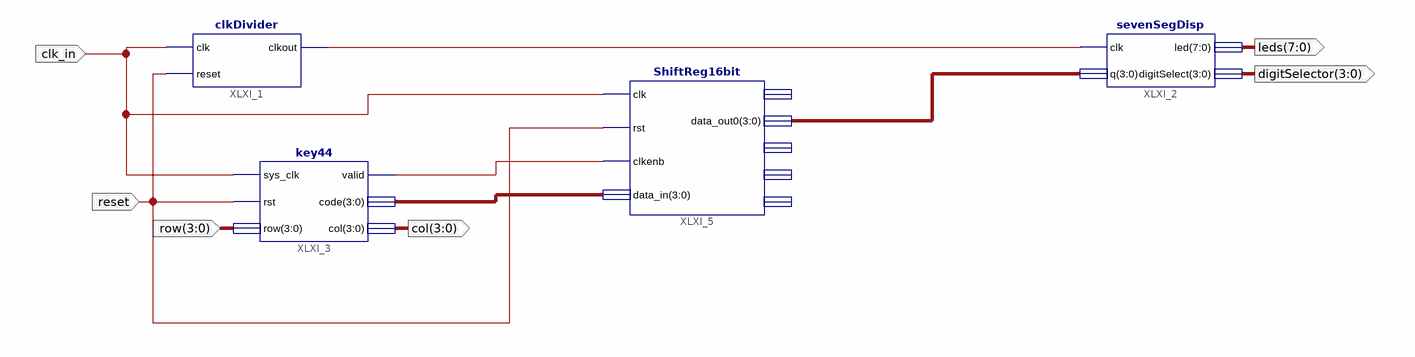
[diagram p0: schematic sheet 1]
// Xilinx ISE schematic top.sch (spartan3e) as structural Verilog: 4 symbols, 6 ports
module top (
  input  clk_in,
  input  reset,
  input  [3:0] row,
  output [3:0] col,
  output [7:0] leds,
  output [3:0] digitSelector
);

  wire XLXN_3, XLXN_13;
  wire [3:0] XLXN_11, XLXN_12;

  clkDivider XLXI_1 (.clk(clk_in), .reset(reset), .clkout(XLXN_3));
  key44 XLXI_3 (.sys_clk(clk_in), .rst(reset), .row(row), .valid(XLXN_13), .code(XLXN_11), .col(col));
  ShiftReg16bit XLXI_5 (
    .clk(clk_in), .rst(reset), .clkenb(XLXN_13), .data_in(XLXN_11), .data_out0(XLXN_12));  // open: data_out16, data_out1, data_out2, data_out3
  sevenSegDisp XLXI_2 (.clk(XLXN_3), .q(XLXN_12), .led(leds), .digitSelect(digitSelector));
endmodule
